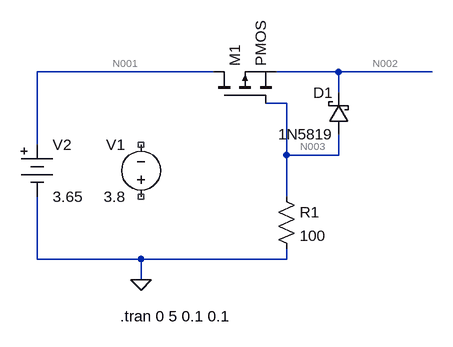
[diagram p0: schematic Battery Polarity Protector.asc]
Battery Polarity Protector.asc, the LTspice schematic file:
Version 4
SHEET 1 880 680
WIRE 160 48 -112 48
WIRE 352 48 256 48
WIRE 496 48 352 48
WIRE 352 80 352 48
WIRE 272 96 240 96
WIRE -112 160 -112 48
WIRE 272 176 272 96
WIRE 352 176 352 144
WIRE 352 176 272 176
WIRE 272 240 272 176
WIRE -112 336 -112 240
WIRE 48 336 -112 336
WIRE 272 336 272 320
WIRE 272 336 48 336
WIRE 48 368 48 336
FLAG 48 368 0
SYMBOL voltage 48 256 R180
WINDOW 0 24 96 Left 2
WINDOW 3 24 16 Left 2
WINDOW 123 0 0 Left 0
WINDOW 39 0 0 Left 0
SYMATTR InstName V1
SYMATTR Value 3.8
SYMBOL res 256 224 R0
SYMATTR InstName R1
SYMATTR Value 100
SYMBOL pmos 160 96 R270
SYMATTR InstName M1
SYMBOL schottky 368 144 R180
WINDOW 0 24 64 Left 2
WINDOW 3 24 0 Left 2
SYMATTR InstName D1
SYMATTR Value 1N5819
SYMATTR Description Zener Diode
SYMATTR Type zener
SYMBOL Misc\\battery -112 144 R0
WINDOW 123 0 0 Left 0
WINDOW 39 0 0 Left 0
SYMATTR InstName V2
SYMATTR Value 3.65
TEXT 16 424 Left 2 !.tran 0 5 0.1 0.1

The netlist it stands for:
* Battery Polarity Protector.asc
V1 NC_01 NC_02 3.8
R1 N003 0 100
M1 N001 N003 N002 N002 PMOS
D1 N003 N002 1N5819
V2 N001 0 3.65
.model D D
.lib standard.dio
.model NMOS NMOS
.model PMOS PMOS
.lib standard.mos
.tran 0 5 0.1 0.1
.backanno
.end

* Results of the author's LTspice run, read from the files saved beside the schematic
* Operating Point, zero values left out:
*   V(n003) = 3.17 mV
*   V(n001) = 3.65 V
*   V(n002) = 3.193 V
*   Id(M1) = 31.7 µA
*   Ib(M1) = -468.1 nA
*   Is(M1) = -31.23 µA
*   I(D1) = -31.7 µA
*   I(R1) = 31.7 µA
*   I(V2) = -31.7 µA